# EasyEDA Pro project PRJ_Camera_Light V0.1a.epro

# Schematic Camera Light
Board Name: Camera Light; Create Date: 2025-01-24; Page Name: LED matrix; Project Name: PnP_Lights; Schematic Name: Camera Light; Update Date: 2025-03-21; Company: Orion Electronics; Drawn: Giovanni C.; Page Size: A4; Version: V0.1a
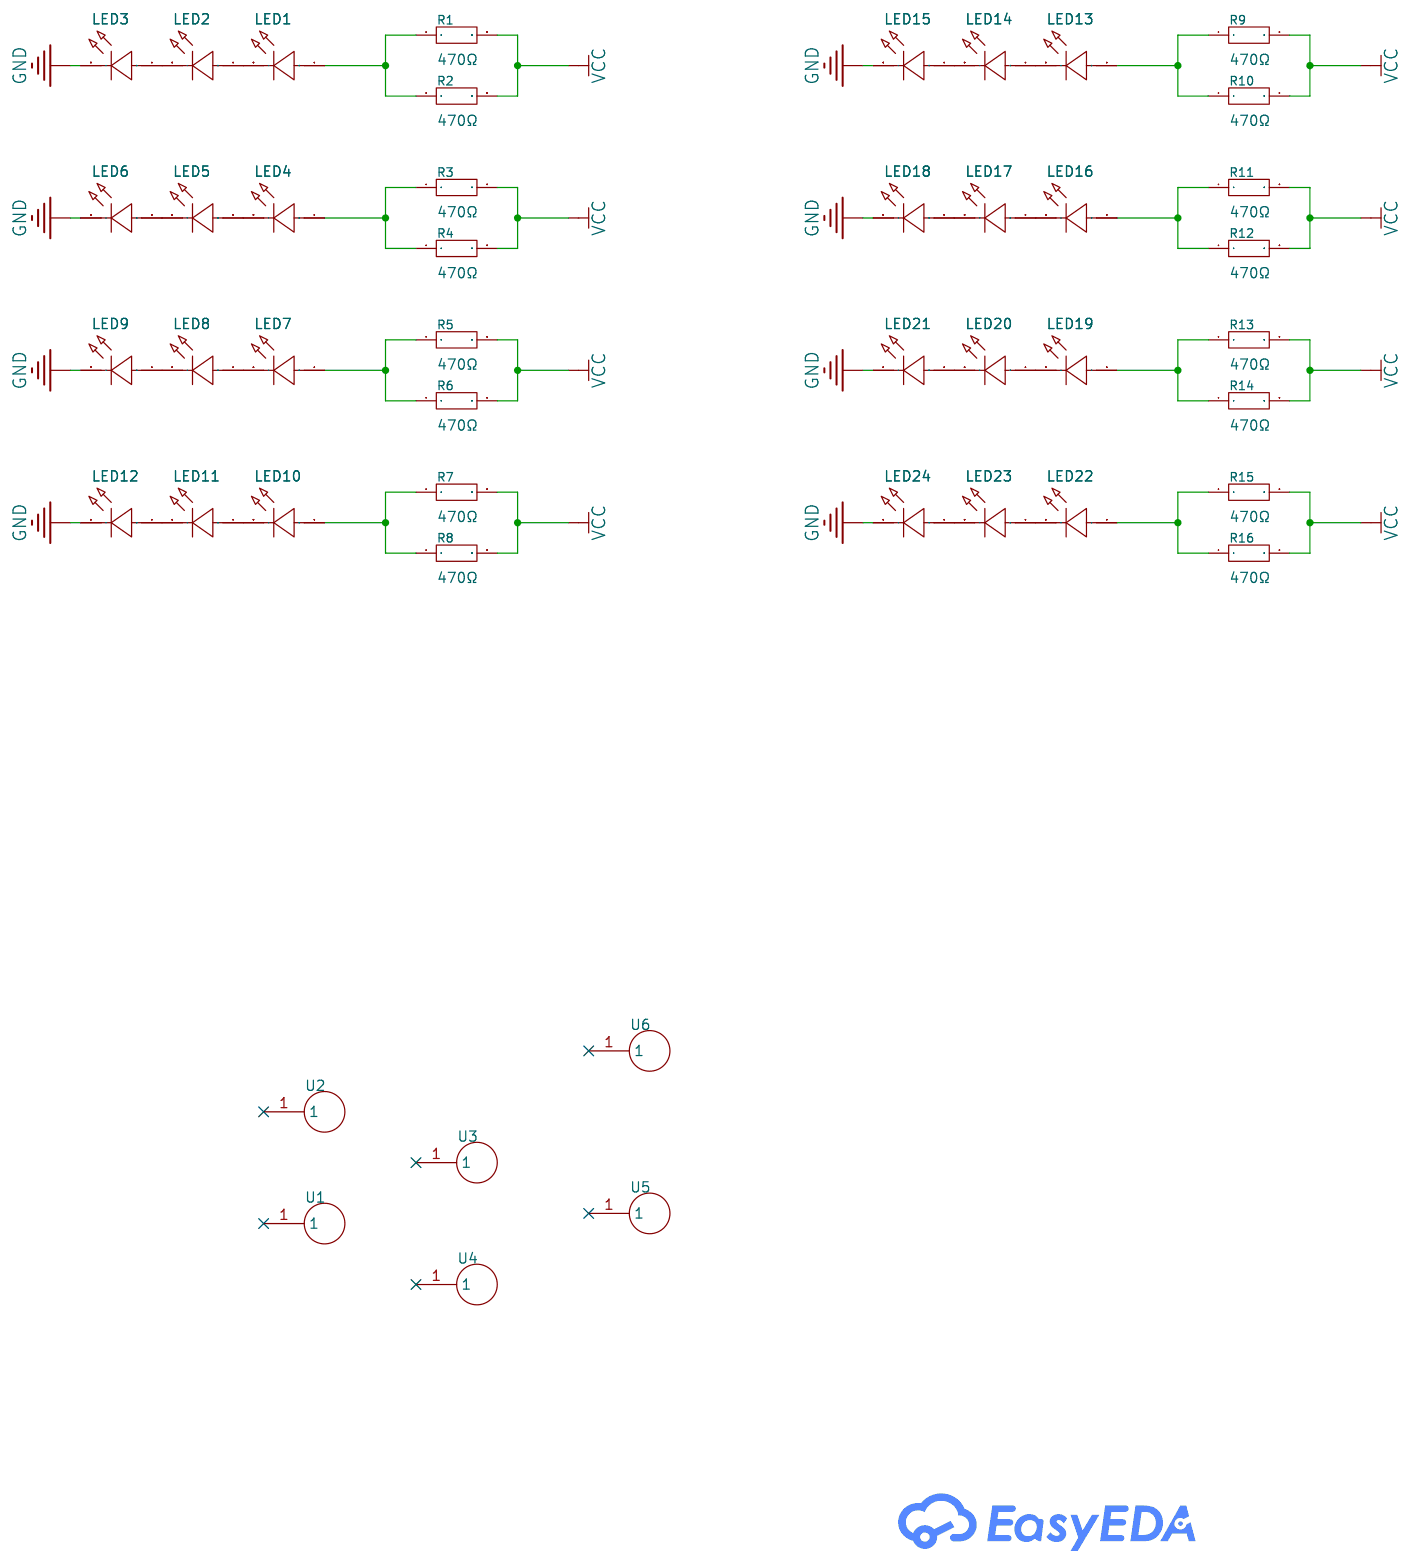
[diagram p0: schematic sheet]

## Parts
LED1  SZYY1206W  [LED1206-R-RD_WHITE]
LED2  SZYY1206W  [LED1206-R-RD_WHITE]
LED3  SZYY1206W  [LED1206-R-RD_WHITE]
LED4  SZYY1206W  [LED1206-R-RD_WHITE]
LED5  SZYY1206W  [LED1206-R-RD_WHITE]
LED6  SZYY1206W  [LED1206-R-RD_WHITE]
LED7  SZYY1206W  [LED1206-R-RD_WHITE]
LED8  SZYY1206W  [LED1206-R-RD_WHITE]
LED9  SZYY1206W  [LED1206-R-RD_WHITE]
LED10  SZYY1206W  [LED1206-R-RD_WHITE]
LED11  SZYY1206W  [LED1206-R-RD_WHITE]
LED12  SZYY1206W  [LED1206-R-RD_WHITE]
LED13  SZYY1206W  [LED1206-R-RD_WHITE]
LED14  SZYY1206W  [LED1206-R-RD_WHITE]
LED15  SZYY1206W  [LED1206-R-RD_WHITE]
LED16  SZYY1206W  [LED1206-R-RD_WHITE]
LED17  SZYY1206W  [LED1206-R-RD_WHITE]
LED18  SZYY1206W  [LED1206-R-RD_WHITE]
LED19  SZYY1206W  [LED1206-R-RD_WHITE]
LED20  SZYY1206W  [LED1206-R-RD_WHITE]
LED21  SZYY1206W  [LED1206-R-RD_WHITE]
LED22  SZYY1206W  [LED1206-R-RD_WHITE]
LED23  SZYY1206W  [LED1206-R-RD_WHITE]
LED24  SZYY1206W  [LED1206-R-RD_WHITE]
R1  470Ω  [R0805]
R2  470Ω  [R0805]
R3  470Ω  [R0805]
R4  470Ω  [R0805]
R5  470Ω  [R0805]
R6  470Ω  [R0805]
R7  470Ω  [R0805]
R8  470Ω  [R0805]
R9  470Ω  [R0805]
R10  470Ω  [R0805]
R11  470Ω  [R0805]
R12  470Ω  [R0805]
R13  470Ω  [R0805]
R14  470Ω  [R0805]
R15  470Ω  [R0805]
R16  470Ω  [R0805]
U1  -  [FID_CUST]
U2  -  [FID_CUST]
U3  -  [FID_CUST]
U4  -  [FID_CUST]
U5  -  [FID_CUST]
U6  -  [FID_CUST]

## Library data of the parts
LED1-LED24 = SZYY1206W: Emitted Color:White Power Dissipation:100mW Forward Current:5mA Dominant Wavelength:- Dominant Wavelength:- Peak Wavelength:- Diode Configuration:- Lens Color:黄色透镜 Color Temperature:- Color Temperature:- Viewing Angle:120° Mounting Sytle:- Operating Tempe; LCSC Part Name: 白灯; Supplier Part: C434441; Manufacturer: yongyu(永裕光电); Supplier Footprint: 1206; JLCPCB Part Class: Extended Part; Datasheet: https://atta.szlcsc.com/upload/public/pdf/source/20200827/C434441_AEC1A0F5A7509ABFDF7122D1A7047E1C.pdf; Supplier: LCSC; Emitted Color: White; Power Dissipation: 100mW; Forward Current: 5mA; Lens Color: 黄色透镜; Viewing Angle: 120°; Operating Temperature: -40℃~+85℃
R1-R16 = 0805W8F4700T5E: Type:Thick Film Resistors Resistance: Tolerance:±1% Tolerance:±1% Power(Watts): Overload Voltage (Max): Temperature Coefficient:±100ppm/℃ Temperature Coefficient:±100ppm/℃ Operating Temperature Range:-55℃~+155℃ Operating Temperature Range:-55℃~+155℃; LCSC Part Name: 470Ω ±1% 125mW 厚膜电阻; Supplier Part: C17710; Manufacturer: UNI-ROYAL(厚声); Supplier Footprint: 0805; JLCPCB Part Class: Basic Part; Datasheet: https://atta.szlcsc.com/upload/public/pdf/source/20200306/C422600_1E6D84923E4A46A82E41ADD87F860B5C.pdf; Supplier: LCSC; Type: Thick Film Resistors; Tolerance: ±1%; Temperature Coefficient: ±100ppm/℃; Operating Temperature Range: -55℃~+155℃
U1-U6 = FID_CUST: Custom 1MM fiducial

## Nets
GND: LED3.2(-) LED6.2(-) LED9.2(-) LED12.2(-) LED15.2(-) LED18.2(-) LED21.2(-) LED24.2(-)
VCC: R1.2 R2.2 R3.2 R4.2 R5.2 R6.2 R7.2 R8.2 R9.2 R10.2 R11.2 R12.2 R13.2 R14.2 R15.2 R16.2
$1N273: LED1.1(+) R1.1 R2.1
$1N349: LED1.2(-) LED2.1(+)
$1N392: LED2.2(-) LED3.1(+)
$1N669: LED4.2(-) LED5.1(+)
$1N671: LED5.2(-) LED6.1(+)
$1N679: LED4.1(+) R3.1 R4.1
$1N911: LED7.2(-) LED8.1(+)
$1N913: LED8.2(-) LED9.1(+)
$1N921: LED7.1(+) R5.1 R6.1
$1N1153: LED10.2(-) LED11.1(+)
$1N1155: LED11.2(-) LED12.1(+)
$1N1163: LED10.1(+) R7.1 R8.1
$1N2067: LED13.1(+) R9.1 R10.1
$1N2073: LED16.1(+) R11.1 R12.1
$1N2079: LED16.2(-) LED17.1(+)
$1N2081: LED17.2(-) LED18.1(+)
$1N2083: LED13.2(-) LED14.1(+)
$1N2085: LED14.2(-) LED15.1(+)
$1N2087: LED22.2(-) LED23.1(+)
$1N2089: LED22.1(+) R15.1 R16.1
$1N2095: LED23.2(-) LED24.1(+)
$1N2103: LED19.2(-) LED20.1(+)
$1N2105: LED19.1(+) R13.1 R14.1
$1N2129: LED20.2(-) LED21.1(+)

Not connected (* = marked no-connect by the designer): U1 1*; U2 1*; U3 1*; U4 1*; U5 1*; U6 1*

# Board Camera Light
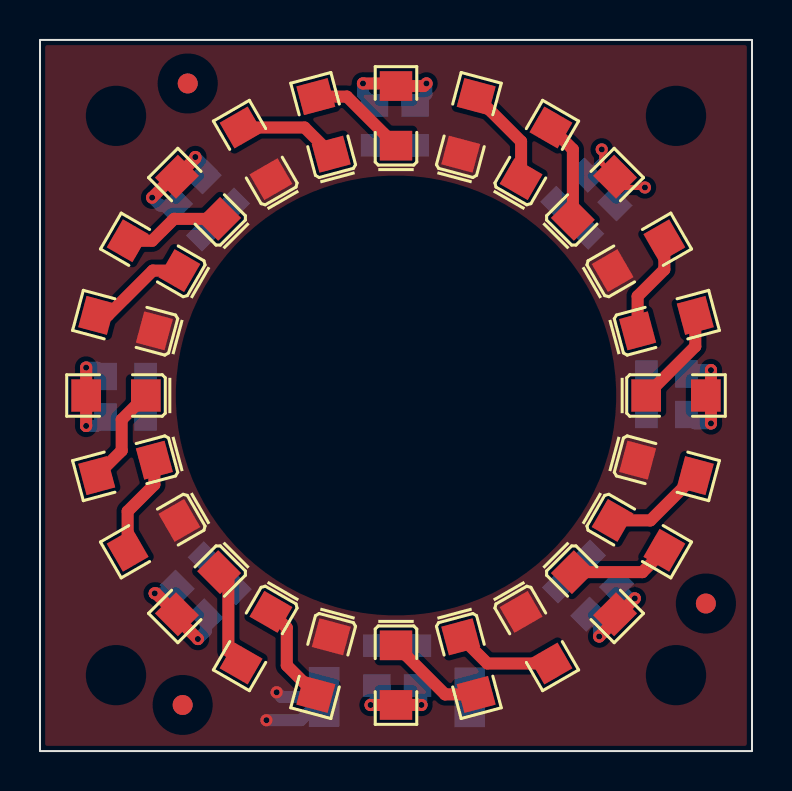
[diagram p1: board, top side]
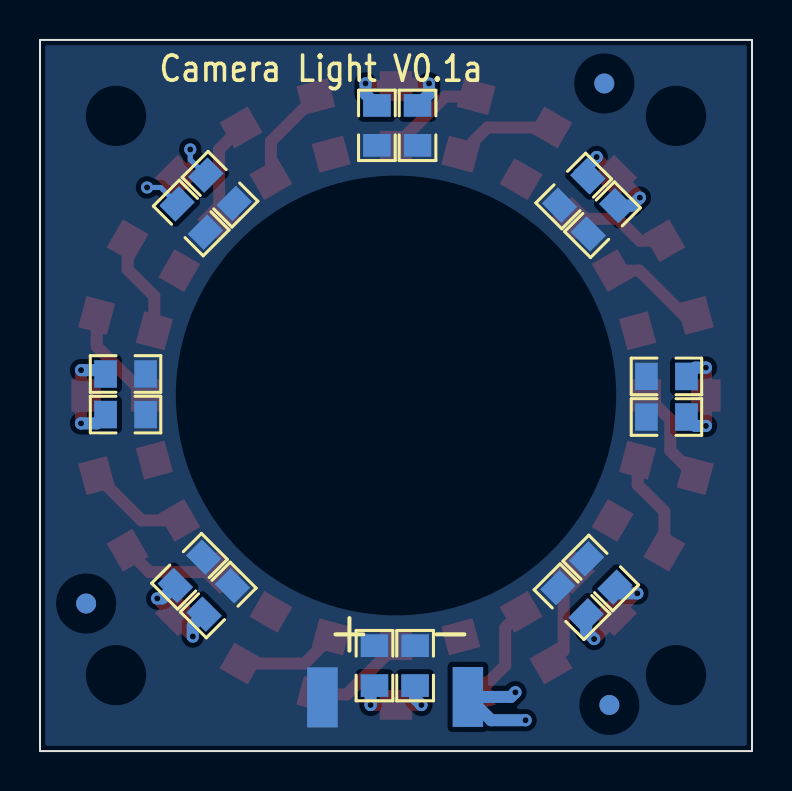
[diagram p2: board, bottom side, seen from below]

Outline 35.6 x 35.6 mm; copper layers: Top Layer, Bottom Layer. Coordinates in mm from the lower left corner of the outline.
Outline path: 0,35.6 0,0 35.6,0 35.6,35.6 0,35.6
Stack: Top Layer 0.035mm / Dielectric1 1.51mm FR4 er 4.5 / Bottom Layer 0.035mm

## Design rules (mm)
template: Custom Config
spacing copperThickness1oz (default): track to track 0.102, other pairs 0.152 to 0.3
spacing copperThickness2oz: track to track 0.203, other pairs 0.152 to 0.3
track width copperThickness1oz (default): min 0.127, default 0.254, max 2.54
track width copperThickness2oz: min 0.203, default 0.254, max 2.54
differential pair differentialPair (default): width min 0.127, default 0.254, max 2.54; gap min 0.152, default 0.152
via viaSize (default): diameter min 0.5, default 0.61, max 10; hole min 0.3, default 0.305, max 6.3

## Placement (name value [footprint] x y rotation side)
LED1  SZYY1206W  [LED1206-R-RD_WHITE]  31.8 17.8 0 top
LED2  SZYY1206W  [LED1206-R-RD_WHITE]  31.32 21.42 15 top
LED3  SZYY1206W  [LED1206-R-RD_WHITE]  29.92 24.8 30 top
LED4  SZYY1206W  [LED1206-R-RD_WHITE]  17.8 31.8 90 top
LED5  SZYY1206W  [LED1206-R-RD_WHITE]  14.18 31.32 105 top
LED6  SZYY1206W  [LED1206-R-RD_WHITE]  10.8 29.92 120 top
LED7  SZYY1206W  [LED1206-R-RD_WHITE]  3.8 17.8 180 top
LED8  SZYY1206W  [LED1206-R-RD_WHITE]  4.28 14.18 195 top
LED9  SZYY1206W  [LED1206-R-RD_WHITE]  5.68 10.8 210 top
LED10  SZYY1206W  [LED1206-R-RD_WHITE]  17.8 3.8 270 top
LED11  SZYY1206W  [LED1206-R-RD_WHITE]  21.42 4.28 285 top
LED12  SZYY1206W  [LED1206-R-RD_WHITE]  24.8 5.68 300 top
LED13  SZYY1206W  [LED1206-R-RD_WHITE]  27.7 27.7 45 top
LED14  SZYY1206W  [LED1206-R-RD_WHITE]  24.8 29.92 60 top
LED15  SZYY1206W  [LED1206-R-RD_WHITE]  21.42 31.32 75 top
LED16  SZYY1206W  [LED1206-R-RD_WHITE]  7.9 27.7 135 top
LED17  SZYY1206W  [LED1206-R-RD_WHITE]  5.68 24.8 150 top
LED18  SZYY1206W  [LED1206-R-RD_WHITE]  4.28 21.42 165 top
LED19  SZYY1206W  [LED1206-R-RD_WHITE]  7.9 7.9 225 top
LED20  SZYY1206W  [LED1206-R-RD_WHITE]  10.8 5.68 240 top
LED21  SZYY1206W  [LED1206-R-RD_WHITE]  14.18 4.28 255 top
LED22  SZYY1206W  [LED1206-R-RD_WHITE]  27.7 7.9 315 top
LED23  SZYY1206W  [LED1206-R-RD_WHITE]  29.92 10.8 330 top
LED24  SZYY1206W  [LED1206-R-RD_WHITE]  31.32 14.18 345 top
NOREF  -  [Pad_e330]  21.48 2.69 0 top
NOREF#2  -  [Pad_e329]  14.21 2.71 0 top
R1  470Ω  [R0805]  31.32 16.84 180 bottom
R2  470Ω  [R0805]  31.32 18.88 180 bottom
R3  470Ω  [R0805]  18.76 31.32 270 bottom
R4  470Ω  [R0805]  16.72 31.32 270 bottom
R5  470Ω  [R0805]  4.28 18.75 0 bottom
R6  470Ω  [R0805]  4.28 16.72 0 bottom
R7  470Ω  [R0805]  16.84 4.28 90 bottom
R8  470Ω  [R0805]  18.88 4.28 90 bottom
R9  470Ω  [R0805]  28.04 26.69 225 bottom
R10  470Ω  [R0805]  26.6 28.12 225 bottom
R11  470Ω  [R0805]  8.91 28.04 315 bottom
R12  470Ω  [R0805]  7.48 26.6 315 bottom
R13  470Ω  [R0805]  7.56 8.91 45 bottom
R14  470Ω  [R0805]  9 7.48 45 bottom
R15  470Ω  [R0805]  26.69 7.56 135 bottom
R16  470Ω  [R0805]  28.12 9 135 bottom
U1  -  [FID_CUST]  7.39 33.42 0 top
U2  -  [FID_CUST]  7.39 33.42 180 bottom
U3  -  [FID_CUST]  33.29 7.39 180 bottom
U4  -  [FID_CUST]  33.29 7.39 0 top
U5  -  [FID_CUST]  7.13 2.31 0 top
U6  -  [FID_CUST]  7.13 2.31 180 bottom

## Footprints (pads in the part's own frame, mm; a bottom-side part is the same pattern mirrored in y, then rotated)
FID_CUST
  round 1 smd: 1(0,0)
LED1206-R-RD_WHITE
  rect 1.485x1.62 smd: 1(1.492,0) 2(-1.492,0)
Pad_e329
  rect 1.524x3 smd far side: 1(0,0)
Pad_e330
  rect 1.524x3 smd far side: 2(0,0)
R0805
  rect 1.133x1.377 smd: 1(-1,0) 2(1,0)

## Nets
As in the schematic, except:
GND: LED3.2 LED6.2 LED9.2 LED12.2 LED15.2 LED18.2 LED21.2 LED24.2 NOREF#2.1
VCC: NOREF.2 R1.2 R2.2 R3.2 R4.2 R5.2 R6.2 R7.2 R8.2 R9.2 R10.2 R11.2 R12.2 R13.2 R14.2 R15.2 R16.2

Pads without a net: U1 1; U2 1; U3 1; U4 1; U5 1; U6 1

## Via types
v1: diameter 0.61, hole 0.305, Top Layer to Bottom Layer, 18 vias

## Routing (per net, layer and track width the routed paths; a pad name or vN(x,y) marks a point on that pad's centre or on a via; arc(x,y) is an arc through that point)
GND: length 5.8
  Bottom Layer w0.6: v1(11.83,2.94) 12.06,2.71 NOREF#2.1 13.04,1.54 v1(11.32,1.54)
$1N273: length 5.6
  Top Layer w0.6: v1(33.55,19.07) 33.55,18.06 LED1.1 33.55,17.54 v1(33.55,16.4)
  Bottom Layer w0.6: v1(33.55,16.4) 32.77,16.4 R1.1 ; v1(33.55,19.07) 32.52,19.07 R2.1
$1N349: length 5
  Top Layer w0.6: LED1.2 32.76,20.26 LED2.1
$1N392: length 5.1
  Top Layer w0.6: 29.88,21.04 29.88,22.77 31.22,24.11 31.22,25.55
$1N669: length 5
  Top Layer w0.6: LED5.1 15.34,32.76 LED4.2
$1N671: length 5.1
  Top Layer w0.6: 14.56,29.88 13.23,31.22 10.05,31.22
$1N679: length 6
  Top Layer w0.6: v1(16.15,33.42) 17.67,33.42 LED4.1 19.2,33.29 v1(19.32,33.42)
  Bottom Layer w0.6: R3.1 19.32,32.89 v1(19.32,33.42) ; R4.1 16.15,32.9 v1(16.15,33.42)
$1N911: length 5
  Top Layer w0.6: LED8.1 4.08,15.04 4.08,16.59 LED7.2
$1N913: length 5.1
  Top Layer w0.6: 5.72,14.56 5.72,13.34 4.38,12 4.38,10.05
$1N921: length 5.2
  Top Layer w0.6: v1(2.31,16.28) 2.31,17.8 ; LED7.1 v1(2.31,19.2)
  Bottom Layer w0.6: v1(2.31,19.2) 2.84,19.2 R5.1 ; v1(2.31,16.28) 2.83,16.28 R6.1
$1N1153: length 5
  Top Layer w0.6: LED11.1 20.26,2.84 LED10.2
$1N1155: length 5.1
  Top Layer w0.6: 25.55,4.38 22.37,4.38 21.04,5.72
$1N1163: length 5.1
  Top Layer w0.6: v1(19.07,2.31) LED10.1 ; v1(16.53,2.31) 18.25,2.31
  Bottom Layer w0.6: v1(19.07,2.31) 19.07,3.08 R8.1 ; R7.1 16.84,2.62 v1(16.53,2.31)
$1N2067: length 6.8
  Top Layer w0.254: v1(30.25,28.21) 29.3,28.21 28.09,29.42 v1(28.09,30.12)
  Bottom Layer w0.254: R10.1 28.09,29.61 v1(28.09,30.12) ; R9.1 29.56,28.21 v1(30.25,28.21)
$1N2073: length 6.2
  Top Layer w0.6: v1(5.61,27.71) 6.5,28.59 7.01,28.59 ; v1(7.77,29.74) 7.77,29.68 6.84,28.75
  Bottom Layer w0.6: R12.1 6.01,27.31 v1(5.61,27.71) ; 8.18,28.74 8.51,28.74 8.63,28.87 v1(7.77,29.74)
$1N2079: length 5
  Top Layer w0.6: 4.38,25.55 5.61,25.55 6.71,26.64 LED16.2
$1N2081: length 5.1
  Top Layer w0.6: LED18.1 3.4,21.81 5.64,24.05 LED17.2
$1N2083: length 5
  Top Layer w0.6: 25.55,31.22 26.64,30.12 LED13.2
$1N2085: length 5.1
  Top Layer w0.6: LED14.2 24.05,30.52 LED15.1
$1N2087: length 5
  Top Layer w0.6: LED22.2 30.12,8.96 31.22,10.05
$1N2089: length 5.4
  Top Layer w0.6: v1(27.96,5.73) 28.94,6.72 28.94,6.84 ; 28.76,6.84 28.94,6.84 ; 28.94,6.84 v1(29.74,7.64)
  Bottom Layer w0.6: R15.1 27.96,6.29 v1(27.96,5.73) ; v1(29.74,7.64) 29.48,7.64 R16.1
$1N2095: length 5.1
  Top Layer w0.6: LED23.2 30.52,11.55 LED24.1
$1N2103: length 5
  Top Layer w0.6: 10.05,4.38 9.42,5.02 9.42,8.49 LED19.2
$1N2105: length 5.8
  Top Layer w0.6: v1(7.89,5.61) 6.84,6.66 6.84,6.84 5.8,7.89 v1(5.74,7.89)
  Bottom Layer w0.6: R14.1 8.29,6.01 v1(7.89,5.61) ; v1(5.74,7.89) 6.54,7.89 R13.1
$1N2129: length 5.1
  Top Layer w0.6: LED20.2 12.34,6.18 12.34,4.29 LED21.1

## Copper pours and planes (outline as drawn; the poured copper is in the pictures)
GND on Top Layer: 0,35.6 35.6,35.6 35.6,0 0,0
VCC on Bottom Layer: 0,35.6 35.6,35.6 35.6,0 0,0

## Text on the board
Bottom Silkscreen Layer: Camera Light V0.1a | -  +
